# Altium schematic sheet EA3036.SchDoc
size A3; Author: Power Lin; SheetNumber: 1; SheetTotal: 1; Website: wiki-power.com
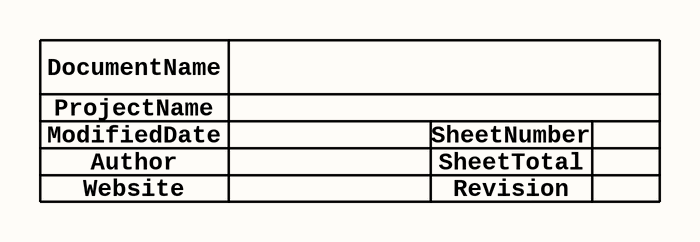
[diagram p0: EA3036.SchDoc]

## Notes on the sheet
- Author
- DocumentName
- ModifiedDate
- ProjectName
- SheetNumber
- SheetTotal
- Website
- Revision